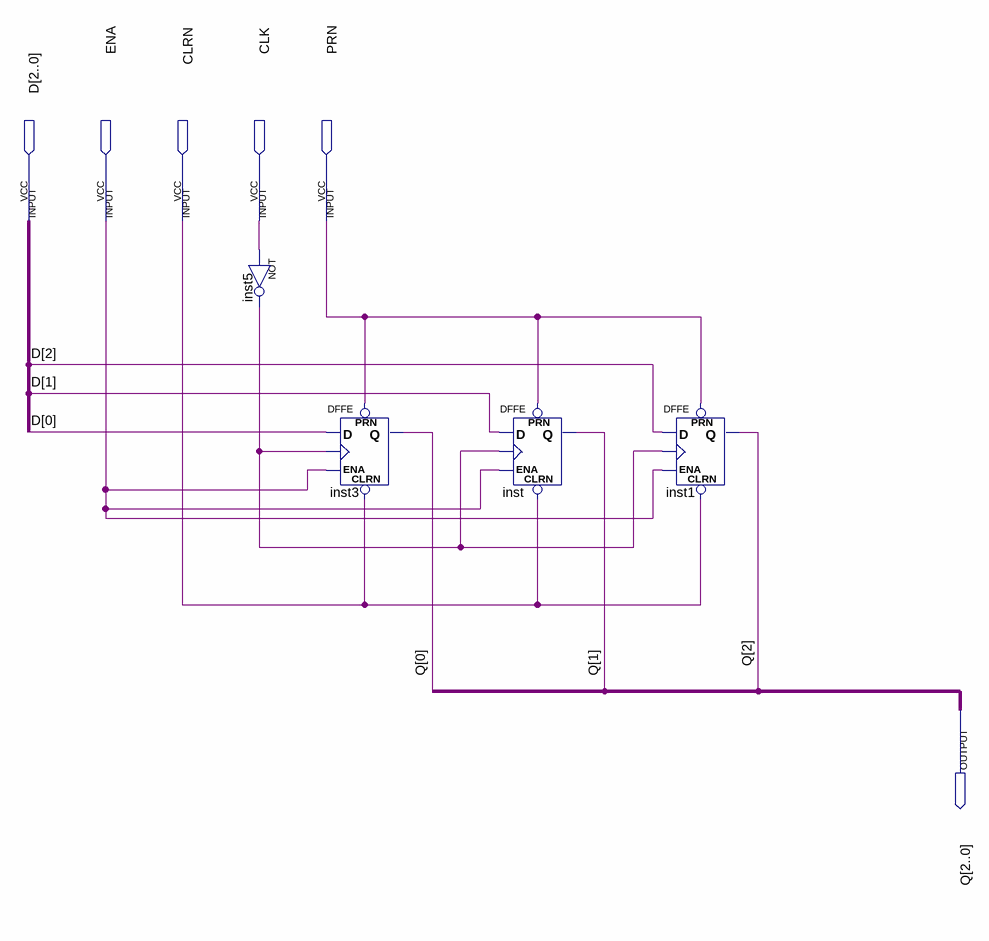
[diagram p0: schematic sheet]
// Quartus schematic dffe3.bdf as structural Verilog: 4 symbols, 6 pins
module dffe3 (
  input  [2:0] D,
  input  ENA,
  input  CLRN,
  input  CLK,
  input  PRN,
  output [2:0] Q
);

  wire inst5_out;

  not inst5 (inst5_out, CLK);
  DFFE inst3 (.PRN(PRN), .CLRN(CLRN), .D(D[0]), .CLK(inst5_out), .ENA(ENA), .Q(Q[0]));
  DFFE inst (.PRN(PRN), .CLRN(CLRN), .D(D[1]), .CLK(inst5_out), .ENA(ENA), .Q(Q[1]));
  DFFE inst1 (.PRN(PRN), .CLRN(CLRN), .D(D[2]), .CLK(inst5_out), .ENA(ENA), .Q(Q[2]));
endmodule
